# Altium project pdmlse_pcb.PrjPcb (part 3 of 4)

## Sheet LDO_AUX.SchDoc
size B; SheetNumber: 3; SheetTotal: 15
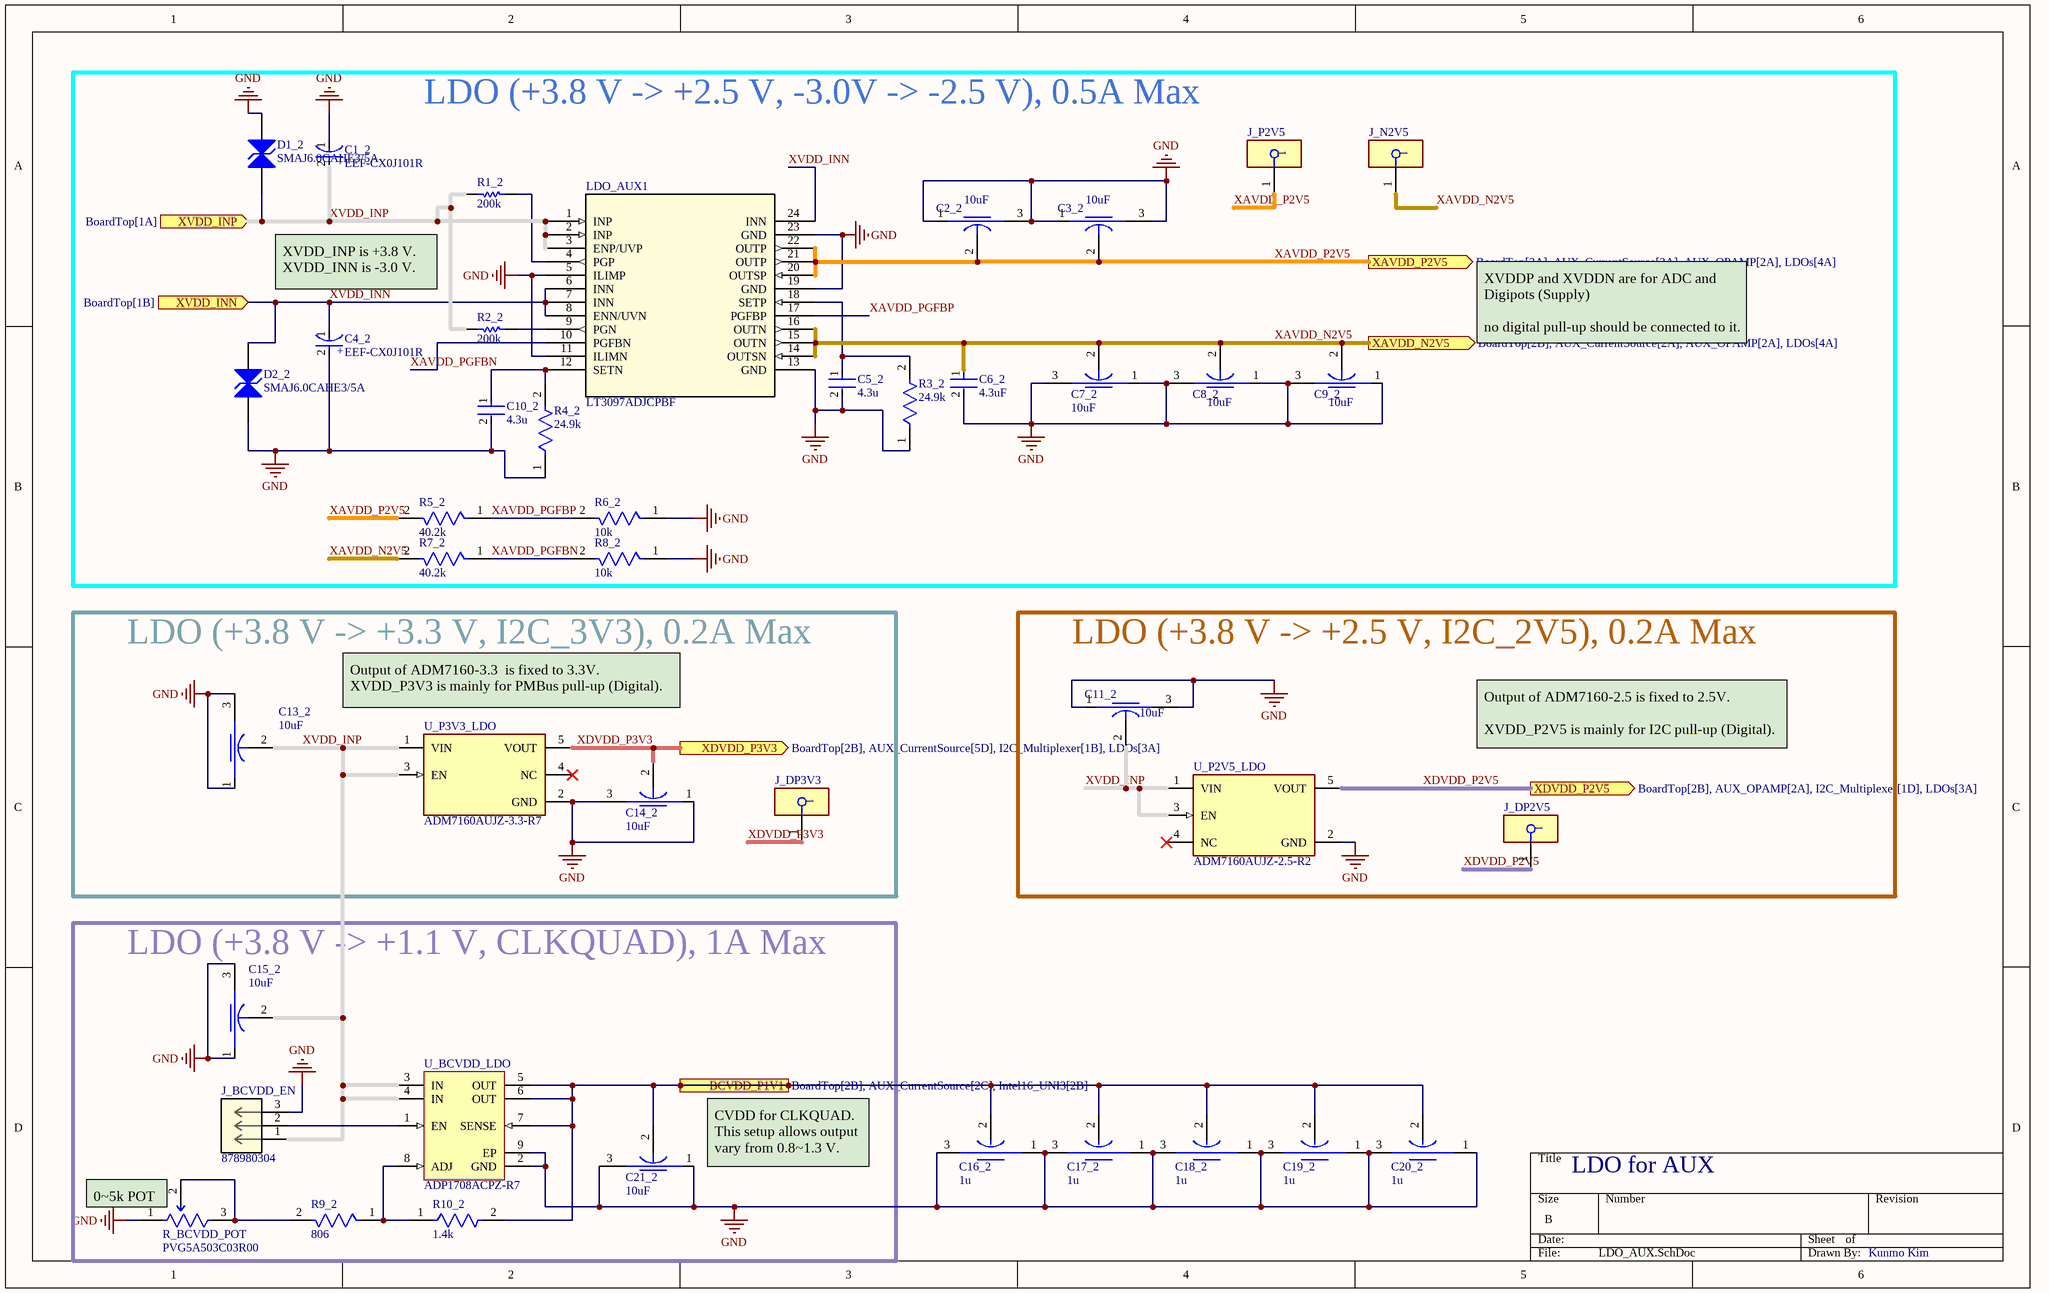
[diagram p5: LDO_AUX.SchDoc]

### Parts
C1_2  EEF-CX0J101R  [FP-CX-MFG]
C2_2  10uF  [FP-NFM15-0_2-MFG]
C3_2  10uF  [FP-NFM15-0_2-MFG]
C4_2  EEF-CX0J101R  [FP-CX-MFG]
C5_2  4.3u  [FP-LLL1U4-0_05-IPC_C]
C6_2  4.3uF  [FP-LLL1U4-0_05-MFG]
C7_2  10uF  [FP-NFM15-0_2-MFG]
C8_2  10uF  [FP-NFM15-0_2-MFG]
C9_2  10uF  [FP-NFM15-0_2-MFG]
C10_2  4.3u  [FP-LLL1U4-0_05-IPC_C]
C11_2  10uF  [FP-NFM15-0_2-MFG]
C13_2  10uF  [FP-NFM15-0_2-MFG]
C14_2  10uF  [FP-NFM15-0_2-MFG]
C15_2  10uF  [FP-NFM15-0_2-MFG]
C16_2  1u  [PCBComponent_1]
C17_2  1u  [PCBComponent_1]
C18_2  1u  [PCBComponent_1]
C19_2  1u  [PCBComponent_1]
C20_2  1u  [PCBComponent_1]
C21_2  10uF  [FP-NFM15-0_2-MFG]
D1_2  SMAJ6.0CAHE3/5A  [VISH-DO-214AC-2_L]
D2_2  SMAJ6.0CAHE3/5A  [VISH-DO-214AC-2_L]
J_BCVDD_EN  878980304  [CONN03_87898_M-5p84_MOL]
J_DP2V5  5019  [FP-5019-MFG]  (value not drawn)
J_DP3V3  5019  [FP-5019-MFG]  (value not drawn)
J_N2V5  5019  [FP-5019-MFG]  (value not drawn)
J_P2V5  5019  [FP-5019-MFG]  (value not drawn)
LDO_AUX1  LT3097ADJCPBF  [05-08-7071_ADI]
R1_2  200k  [RESC1005X40X25NL05T05]
R2_2  200k  [RESC1005X40X25NL05T05]
R3_2  24.9k  [FP-ERJ2RK-MFG]
R4_2  24.9k  [FP-ERJ2RK-MFG]
R5_2  40.2k  [FP-ERJ2RK-MFG]
R6_2  10k  [FP-ERA2A-MFG]
R7_2  40.2k  [FP-ERJ2RK-MFG]
R8_2  10k  [FP-ERA2A-MFG]
R9_2  806  [FP-ERJ2RK-MFG]
R10_2  1.4k  [FP-RT0603-MFG]
R_BCVDD_POT  PVG5A503C03R00  [FP-PVG5A-MFG]
U_BCVDD_LDO  ADP1708ACPZ-R7  [ADI-CP-8-2_N]
U_P2V5_LDO  ADM7160AUJZ-2.5-R2  [FP-UJ-5-IPC_A]
U_P3V3_LDO  ADM7160AUJZ-3.3-R7  [FP-UJ-5-IPC_A]

### Blocks framed on the sheet
LDO (+3.8 V -> +2.5 V, -3.0V -> -2.5 V), 0.5A Max: C1_2 C2_2 C3_2 C4_2 C5_2 C6_2 C7_2 C8_2 C9_2 C10_2 D1_2 D2_2 J_N2V5 J_P2V5 LDO_AUX1 R1_2 R2_2 R3_2 R4_2 R5_2 R6_2 R7_2 R8_2
LDO (+3.8 V -> +3.3 V, I2C_3V3), 0.2A Max: C13_2 C14_2 J_DP3V3 U_P3V3_LDO
LDO (+3.8 V -> +2.5 V, I2C_2V5), 0.2A Max: C11_2 J_DP2V5 U_P2V5_LDO
LDO (+3.8 V -> +1.1 V, CLKQUAD), 1A Max: C15_2 C21_2 J_BCVDD_EN R9_2 R10_2 R_BCVDD_POT U_BCVDD_LDO

### Ports
BCVDD_P1V1 (out, see BoardTop[2B], AUX_CurrentSource[2C], Intel16_UNI3[2B]), XAVDD_N2V5 (out, see BoardTop[2B], AUX_CurrentSource[2A], AUX_OPAMP[2A], LDOs[4A]), XAVDD_P2V5 (out, see BoardTop[2A], AUX_CurrentSource[2A], AUX_OPAMP[2A], LDOs[4A]), XDVDD_P2V5 (out, see BoardTop[2B], AUX_OPAMP[2A], I2C_Multiplexer[1D], LDOs[3A]), XDVDD_P3V3 (out, see BoardTop[2B], AUX_CurrentSource[5D], I2C_Multiplexer[1B], LDOs[3A]), XVDD_INN (in, see BoardTop[1B]), XVDD_INP (in, see BoardTop[1A])

### Nets
GND: C1_2.1(C) C2_2.1(Input) C2_2.3(Output) C3_2.1(Input) C3_2.3(Output) C4_2.2(A) C5_2.2 C6_2.2 C7_2.1(Input) C7_2.3(Output) C8_2.1(Input) C8_2.3(Output) C9_2.1(Input) C9_2.3(Output) C10_2.2 C11_2.1(Input) C11_2.3(Output) C13_2.1(Input) C13_2.3(Output) C14_2.1(Input) C14_2.3(Output) C15_2.1(Input) C15_2.3(Output) C16_2.1(Input) C16_2.3(Output) C17_2.1(Input) C17_2.3(Output) C18_2.1(Input) C18_2.3(Output) C19_2.1(Input) C19_2.3(Output) C20_2.1(Input) C20_2.3(Output) C21_2.1(Input) C21_2.3(Output) D1_2.2(A2) D2_2.1(A1) J_BCVDD_EN.3 LDO_AUX1.5(ILIMP) LDO_AUX1.11(ILIMN) LDO_AUX1.13(GND) LDO_AUX1.19(GND) LDO_AUX1.23(GND) R3_2.1 R4_2.1 R6_2.1 R8_2.1 R_BCVDD_POT.1(CCW) U_BCVDD_LDO.2(GND) U_BCVDD_LDO.9(EP) U_P2V5_LDO.2(GND) U_P3V3_LDO.2(GND)
XAVDD_N2V5: C6_2.1 C7_2.2(GND) C8_2.2(GND) C9_2.2(GND) J_N2V5.1 LDO_AUX1.14(OUTSN) LDO_AUX1.15(OUTN) LDO_AUX1.16(OUTN) R7_2.2 ; port XAVDD_N2V5
XAVDD_P2V5: C2_2.2(GND) C3_2.2(GND) J_P2V5.1 LDO_AUX1.20(OUTSP) LDO_AUX1.21(OUTP) LDO_AUX1.22(OUTP) R5_2.2 ; port XAVDD_P2V5
XDVDD_P2V5: J_DP2V5.1 U_P2V5_LDO.5(VOUT) ; port XDVDD_P2V5
XDVDD_P3V3: C14_2.2(GND) J_DP3V3.1 U_P3V3_LDO.5(VOUT) ; port XDVDD_P3V3
BCVDD_P1V1: C16_2.2(GND) C17_2.2(GND) C18_2.2(GND) C19_2.2(GND) C20_2.2(GND) C21_2.2(GND) R10_2.2 U_BCVDD_LDO.5(OUT) U_BCVDD_LDO.6(OUT) U_BCVDD_LDO.7(SENSE) ; port BCVDD_P1V1
XAVDD_PGFBN: LDO_AUX1.10(PGFBN) R7_2.1 R8_2.2
XAVDD_PGFBP: LDO_AUX1.17(PGFBP) R5_2.1 R6_2.2
XVDD_INN: C4_2.1(C) D2_2.2(A2) LDO_AUX1.6(INN) LDO_AUX1.7(INN) LDO_AUX1.8(ENN/UVN) LDO_AUX1.24(INN) ; port XVDD_INN
XVDD_INP: C1_2.2(A) C11_2.2(GND) C13_2.2(GND) C15_2.2(GND) D1_2.1(A1) J_BCVDD_EN.1 LDO_AUX1.1(INP) LDO_AUX1.2(INP) LDO_AUX1.3(ENP/UVP) R1_2.2 R2_2.2 U_BCVDD_LDO.3(IN) U_BCVDD_LDO.4(IN) U_P2V5_LDO.1(VIN) U_P2V5_LDO.3(EN) U_P3V3_LDO.1(VIN) U_P3V3_LDO.3(EN) ; port XVDD_INP
NetC5_2_1: C5_2.1 LDO_AUX1.18(SETP) R3_2.2
NetC10_2_1: C10_2.1 LDO_AUX1.12(SETN) R4_2.2
NetJ_BCVDD_EN_2: J_BCVDD_EN.2 U_BCVDD_LDO.1(EN)
NetLDO_AUX1_4: LDO_AUX1.4(PGP) R1_2.1
NetLDO_AUX1_9: LDO_AUX1.9(PGN) R2_2.1
NetR9_2_1: R9_2.1 R10_2.1 U_BCVDD_LDO.8(ADJ)
NetR9_2_2: R9_2.2 R_BCVDD_POT.2(WIPER) R_BCVDD_POT.3(CW)

Not connected (* = marked no-connect by the designer): U_P2V5_LDO 4(NC)*; U_P3V3_LDO 4(NC)*

### Notes on the sheet
- XVDD_INP is +3.8 V.
  XVDD_INN is -3.0 V.
- XVDDP and XVDDN are for ADC and Digipots (Supply)
  no digital pull-up should be connected to it.
- (near U_P3V3_LDO) Output of ADM7160-3.3  is fixed to 3.3V.
  XVDD_P3V3 is mainly for PMBus pull-up (Digital).
- Output of ADM7160-2.5 is fixed to 2.5V.
  XVDD_P2V5 is mainly for I2C pull-up (Digital).
- (near C21_2) CVDD for CLKQUAD.
  This setup allows output
  vary from 0.8~1.3 V.
- LDO for AUX
- (near R_BCVDD_POT) 0~5k POT
- Kunmo Kim
- (in symbol CMP-05427-000056-1) +

### Library data of the parts
C1_2 C4_2 = CMP-05427-000056-1: CAP ALUM POLY 100UF 20% 6.3V SMD; Leakage Current: 63uA; Polarity: Polar; Lead Diameter: 2.4mm; Dissipation Factor: 0.06%; Ripple Current: 2.7A; ESR (Equivalent Series Resistance): 15mR; Life (Hours): 1000Hour; Voltage Rating: 6.3V; Case/Package: 2917; Lead Pitch: 1.3mm; Series: SP-Cap CX; Weight: 0.004586oz; Radiation Hardening: No; Case Code (Imperial): 2917; Length: 7.3mm; Number of Pins: 2; Lead Free: Lead Free; REACH SVHC: No SVHC; Max Operating Temperature: 105°C; Package Quantity: 3500; Packaging: Tape and Reel; Height - Seated (Max): 0.075inch; Mount: Surface Mount; Height: 1.9mm; Termination: SMD/SMT; Voltage: 6.3V; Construction: Flat; Width: 0.169inch; Ripple Current (AC): 2.7A; Capacitance: 100uF; Voltage Rating (DC): 6.3V; Case Code (Metric): 7343; Min Operating Temperature: -40°C; Tolerance: 20%; RoHS Compliant: Yes; Depth: 4.3mm
C2_2 C3_2 C7_2 C8_2 C9_2 C11_2 C13_2 C14_2 C15_2 C21_2 = CMP-06053-000058-1: CAP FEEDTHRU
C5_2 C6_2 C10_2 = CMP-06035-061933-1: as C9_1 on sheet LDOs; Capacitance: 4.3uF; Tolerance: 20%; Voltage Rating: 4V; Min Operating Temperature: -55°C; Case/Package: 0204; Mount: Surface Mount; Max Operating Temperature: 85°C; Packaging: Tape and Reel; RoHS Compliant: Yes
C16_2 C17_2 C18_2 C19_2 C20_2 = CMP-06053-000757-1: as C12_1 on sheet LDOs; Case/Package: 0402; Max Operating Temperature: 125°C; Min Operating Temperature: -55°C; Mount: Surface Mount; Ratings: AEC-Q200; Series: EMIFIL®, NFM15; Tolerance: 20%; Voltage Rating: 4V; Supplier 1: Mouser; Supplier Part Number 1: 81-NFM15HC105D0G3D
D1_2 D2_2 = CMP-0548-00108-2: Transient Voltage Suppressor, 6.40 to 231 V, 6 V Stand-off Voltage, Bi-Directional, -55 to 155 degC, 2-pin DO-214AC, Pb-Free, Tape and Reel; Manufacturer: Vishay Semiconductor; VBR Bi-Directional (V): 6.4 to 231; VWM (V): 6; IFSM: 40 A; ID (uA): 1600; PPPM (W): 400, 300; PackageDescription: 2-Pin DO-214AC (SMA), Body 4.245 x 2.665 mm; Packing: Tape and Reel; RoHS: TRUE; ComponentLink3Description: Package Specification; ComponentLink2Description: Datasheet; Mounting Technology: Surface Mount; Operating Junction and Storage Temperature Range: -55 to 150 degC; ComponentLink2URL: http://www.vishay.com/docs/88390/smaj50a.pdf; ComponentLink1Description: Manufacturer URL; DatasheetVersion: 12/8/2013; PackageReference: DO-214AC-2; ComponentLink3URL: http://www.vishay.com/docs/88390/smaj50a.pdf; PartNumber: SMAJ6.0CAHE3/5A; ComponentLink1URL: http://www.vishay.com/; Supplier 1: Mouser; Supplier Part Number 1: 78-SMAJ6.0CAHE3_A/H
J_BCVDD_EN = 878980304: as J_DBG_CTRL0 on sheet BoardTop; RefDes: RefDes; Type: Type
J_DP2V5 J_DP3V3 J_N2V5 J_P2V5 = CMP-1672-00008-2: NexarPartId: 22052288; Number of Contacts: 1; Contact Material: Bronze, Silver; Number of Pins: 1; Lead Free: Lead Free; Packaging: Tape and Reel; Mount: Surface Mount; Height: 2.286mm; Contact Plating: Silver; Material: Bronze; Termination: SMD/SMT; REACH SVHC: No SVHC; RoHS: Compliant
LDO_AUX1 = LT3097ADJCPBF: No Description Available; Mfr_Name: Analog Devices Inc; Type: Power Management; RefDes: RefDes; Supplier 1: Mouser; Supplier Part Number 1: 584-LT3097ADJC#PBF
R1_2 R2_2 = CMP-1011-00768-4: Chip Resistor, 200 KOhm, +/- 1%, 100 mW, -55 to 155 degC, 0402 (1005 Metric), RoHS, Tape and Reel; PartNumber: ERJ-2RKF2003X; Manufacturer: Basic Passives; Case\/Package: 0402; Voltage Rating: 50 V; Power Rating: 100 mW; RoHSCompliant: true; Length: 1 mm; DatasheetVersion: 04/2015; ComponentLink2URL: http://industrial.panasonic.com/cdbs/www-data/pdf/RDA0000/AOA0000C86.pdf; Mount: Surface Mount; PackageDescription: 2-Pin Surface Mount Device, Body 1 x 0.5 mm; Tolerance: 1%; Width: 0.5 mm; ComponentLink2Description: Datasheet; Packaging: Tape and Reel; REACH SVHC: No SVHC; Min Operating Temperature: -55 degC; Package Quantity: 10000; ComponentLink1Description: Manufacturer URL; Height: 0.35 mm; ComponentLink1URL: http://www.panasonic.com/; Mounting Technology: Surface Mount; Case Code (Imperial): 0402; PackageReference: 0402; Radiation Hardening: No; Pins: 2; Max Operating Temperature: 155 degC; Resistance: 200 KOhm; Case Code (Metric): 1005
R3_2 R4_2 = CMP-2002-00806-2: RES SMD 24.9K OHM 1% 1/10W 0402; Voltage Rating (DC): 50V; Temperature Coefficient: 100ppm/°C; Max Power Dissipation: 100mW; Resistance: 24.9kR; Size Code: 0402; Series: ERJ; Package Quantity: 1; Packaging: Tape and Reel; Lead Free: Lead Free; Mount: Surface Mount; Construction: Rectangular; Depth: 0.5mm; Contact Plating: Tin; Length: 1mm; Termination: SMD/SMT; Height: 0.016inch; Military Standard: Not; Voltage Rating: 50V; Resistor Type: Thick Film; Number of Terminations: 2; Case/Package: 0402; REACH SVHC: No SVHC; Case Code (Metric): 1005; Power Rating: 100mW; Tolerance: 1%; Weight: 2.8E-05oz; RoHS Compliant: Yes; Case Code (Imperial): 0402; Max Operating Temperature: 155°C; Features: Automotive AEC-Q200; Width: 0.02inch; Resistance Tolerance: 1%; Min Operating Temperature: -55°C
R5_2 R7_2 = CMP-2002-00919-2: RES SMD 40.2K OHM 1% 1/10W 0402; Max Power Dissipation: 100mW; Voltage Rating (DC): 50V; Temperature Coefficient: 100ppm/°C; Resistance: 40.2kR; Case Code (Metric): 1005; REACH SVHC: No SVHC; Height: 0.35mm; Mount: Surface Mount; Series: ERJ; Width: 0.02inch; Contact Plating: Tin; Number of Terminations: 2; Max Operating Temperature: 155°C; Length: 1mm; Case Code (Imperial): 0402; Construction: Rectangular; Depth: 0.5mm; Features: Automotive AEC-Q200; Weight: 2.8E-05oz; Power Rating: 100mW; Lead Free: Lead Free; Case/Package: 0402; Resistor Type: Thick Film; Termination: SMD/SMT; Voltage Rating: 50V; Package Quantity: 1; Packaging: Tape and Reel; Min Operating Temperature: -55°C; Resistance Tolerance: 1%; Military Standard: Not; Tolerance: 1%; Technology: THICK FILM; RoHS Compliant: Yes
R6_2 R8_2 = CMP-2002-05875-2: RES SMD 10K OHM 0.1% 1/16W 0402; Manufacturer Part Number: ERA-2AEB103X; Manufacturer: Panasonic; Temperature Coefficient: 25ppm/°C; Automotive Grade: Grade 0; Resistance: 10kΩ; Power Rating: 0.063W; Voltage Rating: 50V; Value: 10kΩ; RoHS: TRUE; Device Class L3: Chip SMD Resistors; Automotive: Yes; Series: ERA; Height: 0.4mm; Package: ERA2A; Temperature Range Low: -55°C; ComponentLink2Description: Datasheet; Tolerance: 0.1%; Device Class L2: Resistors; Temperature Range High: +155°C; Device Class L1: Passive Components; Digikey Description: RES SMD 10K OHM 0.1% 1/16W 0402; Category: Res; Mouser Description: Thin Film Resistors - SMD 0402 1/16W 10Kohms; Lead Free: Yes; Footprint Url: https://industrial.panasonic.com/cdbs/www-data/pdf/RDM0000/DMM0000COL17.pdf; Composition: Metal Film; Octopart: https://octopart.com/era-2aeb103x-panasonic-9251377; ComponentLink2URL: https://industrial.panasonic.com/cdbs/www-data/pdf/RDM0000/AOA0000C307.pdf; Temperature: -55°C to +155°C
R9_2 = CMP-2002-01074-4: RES SMD 80.6K OHM 1% 1/10W 0402; NexarPartId: 55421299; Max Power Dissipation: 100mW; Temperature Coefficient: 100ppm/°C; Voltage Rating: 50V; Resistance: 80.6kΩ; Length: 1mm; Number of Terminations: 2; REACH SVHC: No SVHC; Composition: Thick Film; Case Code (Imperial): 0402; RoHS: Compliant; Max Operating Temperature: 155°C; Military Standard: Not; Case Code (Metric): 1005; Depth: 500µm; Termination: SMD/SMT; Contact Plating: Tin; Tolerance: 1%; Voltage Rating (DC): 50V; Min Operating Temperature: -55°C; Case/Package: 0402; Schedule B: 8533210045, 8533210045; Height: 400µm; Power Rating: 100mW; Packaging: Cut Tape (CT); Features: Automotive AEC-Q200; Lead Free: Lead Free; Width: 508µm; Lifecycle Status: Production; Mount: Surface Mount
R10_2 = CMP-03412-033782-1: RES SMD 1.4K OHM 0.1% 1/10W 0603; Manufacturer Part Number: RT0603BRD071K4L; Manufacturer: Yageo; Tolerance: 0.001; Voltage Rating: 75V; Temperature Coefficient: 25 ppm/°C; Resistance: 1.4KΩ; Value: 1.4KΩ; Power Rating: 0.1W; Device Class L3: Chip SMD Resistors; Package: RT0603; RoHS: TRUE; Lead Free: Yes; Footprint Url: http://www.yageo.com/exep/pages/download/literatures/PYu-R_Mount_10.pdf; Device Class L2: Resistors; Ipc Land Pattern Name: RESC16080X45; Digikey Description: RES SMD 1.4K OHM 0.1% 1/10W 0603; ComponentLink2Description: Datasheet; Category: Res; Mouser Description: Res Thin Film 0603 1.4k Ohm 0.1% 1/10W ±25ppm/°C Molded SMD Paper T/R; Temperature: -55°C to +155°C; Temperature Range High: +155°C; Octopart: https://octopart.com/rt0603brd071k4l-yageo-1419726; Device Class L1: Passive Components; ComponentLink2URL: http://www.yageo.com/documents/recent/PYu-RT_1-to-0.01_RoHS_L_9.pdf; Series: RT; Height: 0.55mm; Composition: Thin Film; Temperature Range Low: -55°C; Automotive: No
R_BCVDD_POT = CMP-00059-71526922-1: PVG5A502C03R00 Resistor Trimmer, Cermet, 5 kOhm, ± 10%, 250 mW, 12 Turn, Multi Turn, Surface Mount; Temperature Coefficient: 150ppm/°C; Power Rating: 250mW; Resistance: 5kΩ; Number of Turns: 11; Schedule B: 8533400080, 8533400080|8533400080|8533400080|8533400080|8533400080; RoHS: Compliant; Height: 5.1054mm; Max Operating Temperature: 125°C; Min Operating Temperature: -55°C; Mount: Surface Mount; Max Power Dissipation: 250mW; NexarPartId: 71526922; Tolerance: 10%; Composition: Cermet
U_BCVDD_LDO = CMP-0786-00092-1: 1 A, Low Dropout, CMOS Linear Regulator, 2.5 to 5.5 V Vin, 0.8 to 5 V Vout, Industrial, 8-pin QFN (CP-8-2), Reel; Manufacturer: Analog Devices; Vin (max) (V): 5.5; Iout max: 1A; Vin (min) (V): 2.5; Vout Adjustable Range: 0.8V to 5V; Supply Current IGND @ Small Load: 50uA; ComponentLink4Description: URL Link1; Packing: Reel; ComponentLink2Description: Datasheet; ComponentLink1URL: http://www.analog.com/en/index.html; PackageVersion: 061507-B, 06/2007; PartNumber: ADP1708ACPZ-R7; Mounting Technology: Surface Mount; PackageReference: CP-8-2; PackageDescription: 8-Pin Lead Frame Chip Scale Package, Body 3 x 3 mm, Pitch 0.5 mm; DatasheetVersion: Rev. 0; ComponentLink1Description: Manufacturer URL; ComponentLink2URL: http://www.analog.com/static/imported-files/data_sheets/ADP1706_1707_1708.pdf; ComponentLink3Description: Package Specification; ComponentLink3URL: http://www.analog.com/static/imported-files/packages/56953322593982CP_8_2.pdf; ComponentLink4URL: Product URL:http://www.analog.com/en/ADP1708/productSearch.html
U_P2V5_LDO = CMP-09138-000128-1: IC REG LINEAR 2.5V 200MA TSOT5; Number of Outputs: 1; Max Supply Current: 265uA; Min Input Voltage: 2.2V; Accuracy: 1%; Polarity: Positive; Quiescent Current: 10uA; Max Input Voltage: 5.5V; Power Supply Rejection Ratio (PSRR): 49dB; Output Type: Fixed; Dropout Voltage: 150mV; Min Current Limit: 220mA; Output Current: 200mA; Number of Regulators: 1; Case/Package: TSOT; Max Output Current: 200mA; Nominal Output Voltage: 2.5V; Mount: Surface Mount; Output Voltage: 2.5V; Max Operating Temperature: 125°C; Contact Plating: Tin; REACH SVHC: No SVHC; Min Operating Temperature: -40°C; Packaging: Tape and Reel; Number of Pins: 5; RoHS Compliant: Yes; Lead Free: Contains Lead
U_P3V3_LDO = CMP-09138-000051-1: IC REG LINEAR 3.3V 200MA TSOT5; Min Current Limit: 220mA; Dropout Voltage: 150mV; Number of Outputs: 1; Max Input Voltage: 5.5V; Power Supply Rejection Ratio (PSRR): 49dB; Polarity: Positive; Max Supply Current: 265uA; Accuracy: 1%; Min Input Voltage: 2.2V; Output Type: Fixed; Quiescent Current: 10uA; Mount: Surface Mount; Output Voltage: 3.3V; RoHS Compliant: Yes; Lead Free: Contains Lead; Max Operating Temperature: 125°C; Case/Package: TSOT; Number of Pins: 5; Number of Regulators: 1; Max Output Current: 200mA; Min Operating Temperature: -40°C; Output Current: 200mA; Packaging: Tape and Reel; Contact Plating: Tin

## Sheet AUX_OPAMP.SchDoc
size A4; SheetNumber: 4; SheetTotal: 15
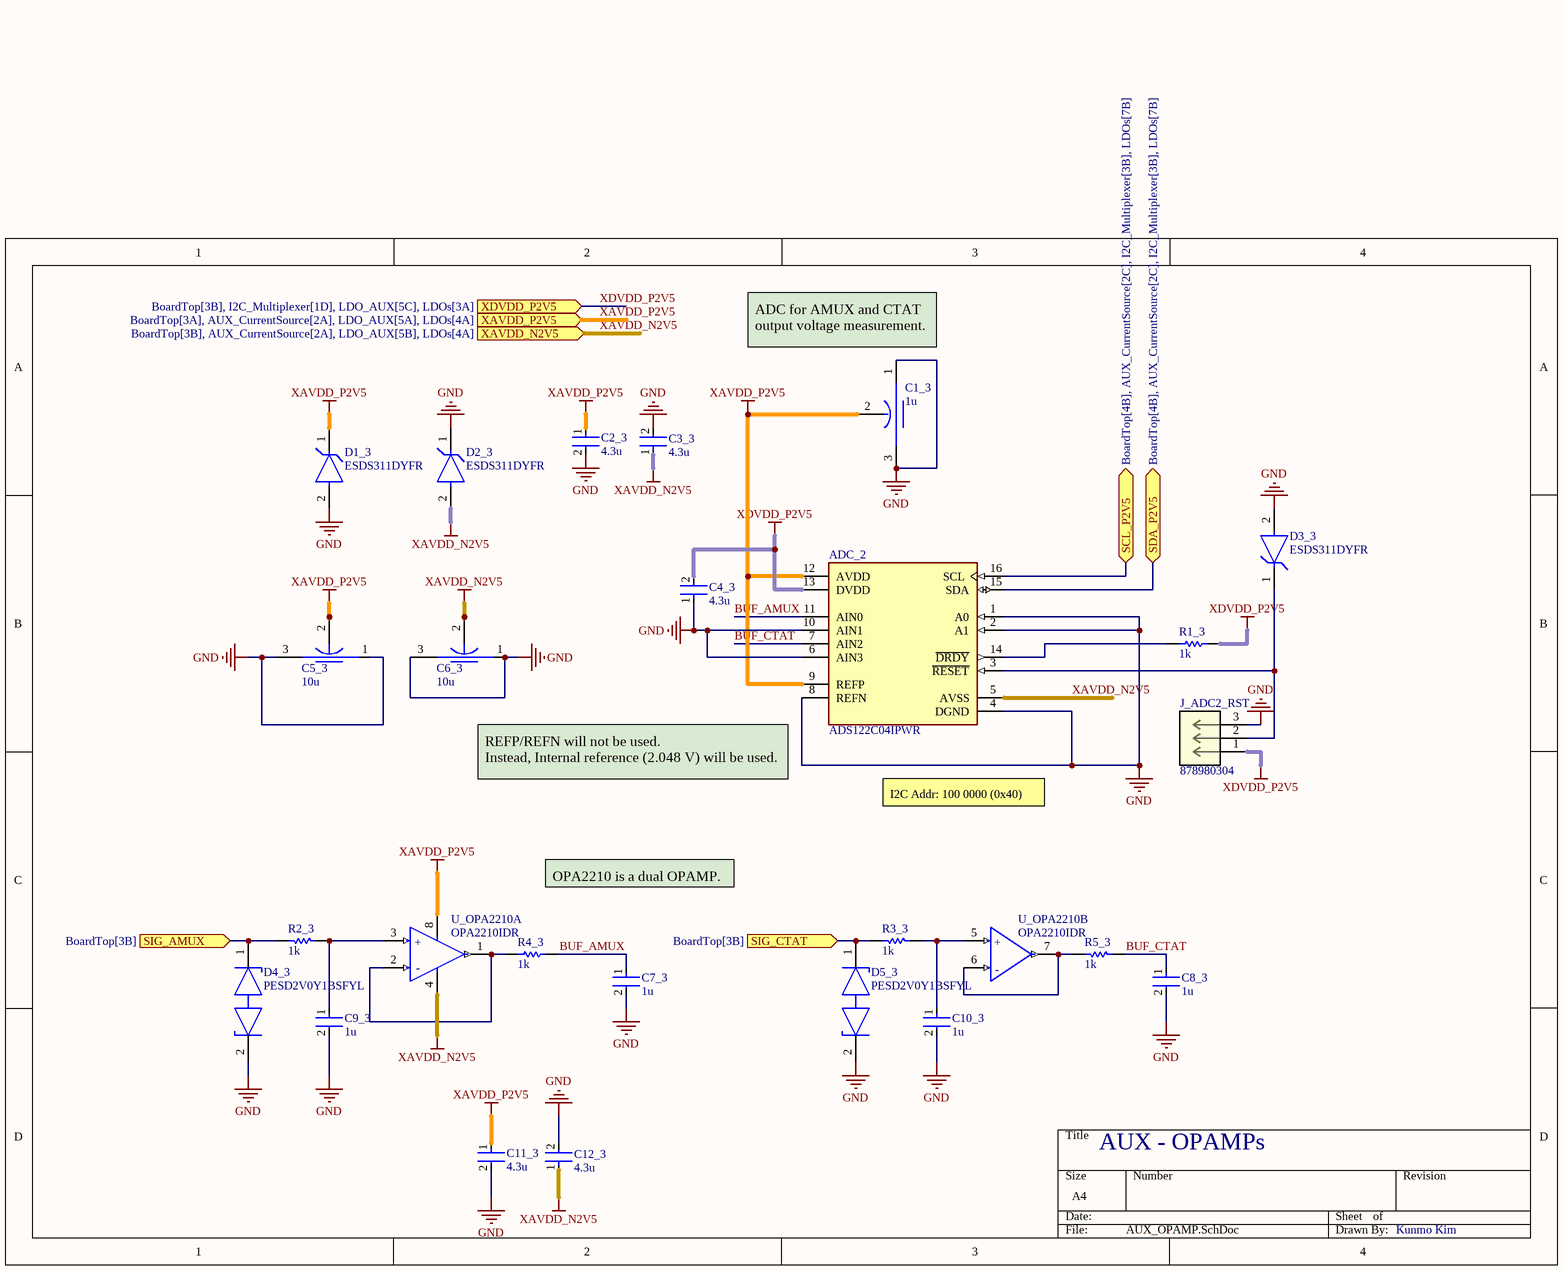
[diagram p6: AUX_OPAMP.SchDoc]

### Parts
ADC_2  ADS122C04IPWR  [FP-PW0016A-IPC_C]
C1_3  1u  [PCBComponent_1]
C2_3  4.3u  [FP-LLL1U4-0_05-MFG]
C3_3  4.3u  [FP-LLL1U4-0_05-MFG]
C4_3  4.3u  [FP-LLL1U4-0_05-MFG]
C5_3  10u  [FP-NFM15-0_2-MFG]
C6_3  10u  [FP-NFM15-0_2-MFG]
C7_3  1u  [FP-C0402C105K8PACTU-IPC_A]
C8_3  1u  [FP-C0402C105K8PACTU-IPC_A]
C9_3  1u  [FP-C0402C105K8PACTU-IPC_A]
C10_3  1u  [FP-C0402C105K8PACTU-IPC_A]
C11_3  4.3u  [FP-LLL1U4-0_05-MFG]
C12_3  4.3u  [FP-LLL1U4-0_05-MFG]
D1_3  ESDS311DYFR  [FP-DYF0002A-IPC_B]
D2_3  ESDS311DYFR  [FP-DYF0002A-IPC_B]
D3_3  ESDS311DYFR  [FP-DYF0002A-IPC_B]
D4_3  PESD2V0Y1BSFYL  [FP-SOD962-2-MFG]
D5_3  PESD2V0Y1BSFYL  [FP-SOD962-2-MFG]
J_ADC2_RST  878980304  [CONN03_87898_M-5p84_MOL]
R1_3  1k  [RESC1608X55X30LL15T15]
R2_3  1k  [RESC1608X55X30LL15T15]
R3_3  1k  [RESC1608X55X30LL15T15]
R4_3  1k  [RESC1608X55X30LL15T15]
R5_3  1k  [RESC1608X55X30LL15T15]
U_OPA2210  OPA2210IDR  [FP-D0008A-MFG]  (parts A,B of 2)

### Ports
SCL_P2V5 (bidir, see BoardTop[4B], AUX_CurrentSource[2C], I2C_Multiplexer[3B], LDOs[7B]), SDA_P2V5 (bidir, see BoardTop[4B], AUX_CurrentSource[2C], I2C_Multiplexer[3B], LDOs[7B]), SIG_AMUX (in, see BoardTop[3B]), SIG_CTAT (in, see BoardTop[3B]), XAVDD_N2V5 (in, see BoardTop[3B], AUX_CurrentSource[2A], LDO_AUX[5B], LDOs[4A]), XAVDD_P2V5 (in, see BoardTop[3A], AUX_CurrentSource[2A], LDO_AUX[5A], LDOs[4A]), XDVDD_P2V5 (in, see BoardTop[3B], I2C_Multiplexer[1D], LDO_AUX[5C], LDOs[3A])

### Nets
GND: ADC_2.1(A0) ADC_2.2(A1) ADC_2.4(DGND) ADC_2.6(AIN3) ADC_2.8(REFN) ADC_2.10(AIN1) C1_3.1(Input) C1_3.3(Output) C2_3.2 C3_3.2 C4_3.1 C5_3.1(Input) C5_3.3(Output) C6_3.1(Input) C6_3.3(Output) C7_3.2 C8_3.2 C9_3.2 C10_3.2 C11_3.2 C12_3.2 D1_3.2(GND) D2_3.1(I/O) D3_3.2(GND) D4_3.2(K2) D5_3.2(K2) J_ADC2_RST.3
XAVDD_N2V5: ADC_2.5(AVSS) C3_3.1 C6_3.2(GND) C12_3.1 D2_3.2(GND) U_OPA2210.4(V-) ; port XAVDD_N2V5
XAVDD_P2V5: ADC_2.9(REFP) ADC_2.12(AVDD) C1_3.2(GND) C2_3.1 C5_3.2(GND) C11_3.1 D1_3.1(I/O) U_OPA2210.8(V+) ; port XAVDD_P2V5
XDVDD_P2V5: ADC_2.13(DVDD) C4_3.2 J_ADC2_RST.1 R1_3.1 ; port XDVDD_P2V5
BUF_AMUX: ADC_2.11(AIN0) C7_3.1 R4_3.1
BUF_CTAT: ADC_2.7(AIN2) C8_3.1 R5_3.2
SCL_P2V5: ADC_2.16(SCL) ; port SCL_P2V5
SDA_P2V5: ADC_2.15(SDA) ; port SDA_P2V5
SIG_AMUX: D4_3.1(K1) R2_3.1 ; port SIG_AMUX
SIG_CTAT: D5_3.1(K1) R3_3.1 ; port SIG_CTAT
NetADC_2_3: ADC_2.3(~{RESET}) D3_3.1(I/O) J_ADC2_RST.2
NetADC_2_14: ADC_2.14(~{DRDY}) R1_3.2
NetC9_3_1: C9_3.1 R2_3.2 U_OPA2210.3(+IN_A)
NetC10_3_1: C10_3.1 R3_3.2 U_OPA2210.5(+IN_B)
NetR4_3_2: R4_3.2 U_OPA2210.1(OUT_A) U_OPA2210.2(-IN_A)
NetR5_3_1: R5_3.1 U_OPA2210.6(-IN_B) U_OPA2210.7(OUT_B)

### Notes on the sheet
- (near C1_3) ADC for AMUX and CTAT
  output voltage measurement.
- REFP/REFN will not be used.
  Instead, Internal reference (2.048 V) will be used.
- I2C Addr: 100 0000 (0x40)
- OPA2210 is a dual OPAMP.
- AUX - OPAMPs
- Kunmo Kim
- (in symbol CMP-04895-000036-1, part A) +; -
- (in symbol CMP-04895-000036-1, part B) +; -

### Library data of the parts
ADC_2 = CMP-04860-000041-1: IC ADC 24BIT SIGMA-DELTA 16TSSOP; Sampling Rate: 2000S/s; Number of Bits: 24; Number of A/D Converters: 1; Number of Inputs: 4; Interface: I2C; Packaging: Tape and Reel; Case/Package: TSSOP; Mount: Surface Mount; RoHS Compliant: Yes; Max Operating Temperature: 125°C; Number of Pins: 16; Min Operating Temperature: -40°C
C1_3 = CMP-06053-000757-1: 0402(1005M) 4V 1.0UF +/- 20% 3 T; Capacitance: 1uF; Current: 2A; Case/Package: 0402; Max Operating Temperature: 125°C; Min Operating Temperature: -55°C; Mount: Surface Mount; Ratings: AEC-Q200; Series: EMIFIL®, NFM15; Tolerance: 20%; Voltage Rating: 4V; Supplier 1: Mouser; Supplier Part Number 1: 81-NFM15HC105D0G3D
C2_3 C3_3 C4_3 C11_3 C12_3 = CMP-06035-061933-1: Cap Ceramic Monolithic 4.3uF 20% 4V X5R 15% 02404 (0610M); Capacitance: 4.3uF; Tolerance: 20%; Min Operating Temperature: -55°C; Case/Package: 0204; Voltage Rating: 4V; Mount: Surface Mount; Max Operating Temperature: 85°C; Packaging: Tape and Reel; RoHS Compliant: Yes
C5_3 C6_3 = CMP-06053-000058-1: CAP FEEDTHRU
C7_3 C8_3 C9_3 C10_3 = CMP-2008-02081-2: CAP CER 1UF 10V X5R 0402; Dielectric Material: Ceramic; Dissipation Factor: 5%; Tolerance: 10%; Number of Pins: 2; Contact Plating: Tin; Min Operating Temperature: -55°C; Termination: SMD/SMT; Lead Free: Lead Free; Construction: Flat; Voltage Rating (DC): 10V; Mount: Surface Mount; Series: C; Thickness: 0.022inch; Width: 0.5mm; Radiation Hardening: No; Capacitance: 1uF; Dielectric: X5R; Height: 0.5mm; Voltage: 10V; Length: 1mm; Depth: 0.5mm; Max Operating Temperature: 85°C; Package Quantity: 1; Packaging: Tape and Reel; RoHS Compliant: Yes; Case Code (Imperial): 0402; Case Code (Metric): 1005; REACH SVHC: No SVHC; Voltage Rating: 10V; Case/Package: 0402; Supplier 1: Mouser; Supplier Part Number 1: 80-C0402C105K8P
D1_3 D2_3 D3_3 = CMP-00370-147271020-1: ESDS311DYFR One-channel unidirectional device for 3.3V surge protection in SOD-323 package 2-SOT -40 to 125; Manufacturer Lifecycle Status: ACTIVE; Number of Pins: 2; Width: 1.7mm; Length: 1.3mm; NexarPartId: 147271020; Height: 0m; Case/Package: SOT; Thickness: 850µm; Lifecycle Status: Production
D4_3 D5_3 = CMP-14436-000022-1: TVS DIODE 2VWM 3VC DSN0603-2
J_ADC2_RST = 878980304: No Description Available; Mfr_Name: Molex Connector Corporation; RefDes: RefDes; Type: Type
R1_3 R2_3 R3_3 R4_3 R5_3 = CMP-2000-00180-1: Part Number: ERJ-3EKF1001V; Manufacturer: Panasonic; Supplier 1: Mouser; Supplier Part Number 1: 667-ERJ-3EKF1001V
U_OPA2210 = CMP-04895-000036-1: IC OP-AMP; Manufacturer: Texas Instruments; Max Dual Supply Voltage: 18V; Nominal Supply Current: 2.2mA; Standoff Height: 0.11mm; Number Of Channels: 2; Max Supply Voltage: 36V; Min Supply Voltage: 4.5V; Max Junction Temp: +150°C; Input Bias Current: 0.0003uA; Min Dual Supply Voltage: 2.25V; Gain Bandwidth: 18MHz; Output Current Per Channel: 65mA; Octopart: https://octopart.com/opa2210idr-texas+instruments-105815795; Temperature Range Low: -55°C; ComponentLink2URL: https://www.ti.com/lit/ds/symlink/opa2210.pdf; Package: D0008A; Ambient Temperature Range Low: -55°C; Manufacturer Part Number: OPA2210IDR; Automotive: No; Temperature Range High: +150°C; Height: 1.75mm; Ambient Temperature Range High: +150°C; ComponentLink2Description: Datasheet; Device Class L2: Linear ICs; Category: IC; Device Class L1: Integrated Circuits (ICs); Digikey Description: IC OP-AMP; Device Class L3: Amplifiers - Op Amps; RoHS: TRUE; Temperature: -55°C to +150°C; Lead Free: Yes

## Sheet AUX_CurrentSource.SchDoc
size B; SheetNumber: 5; SheetTotal: 15
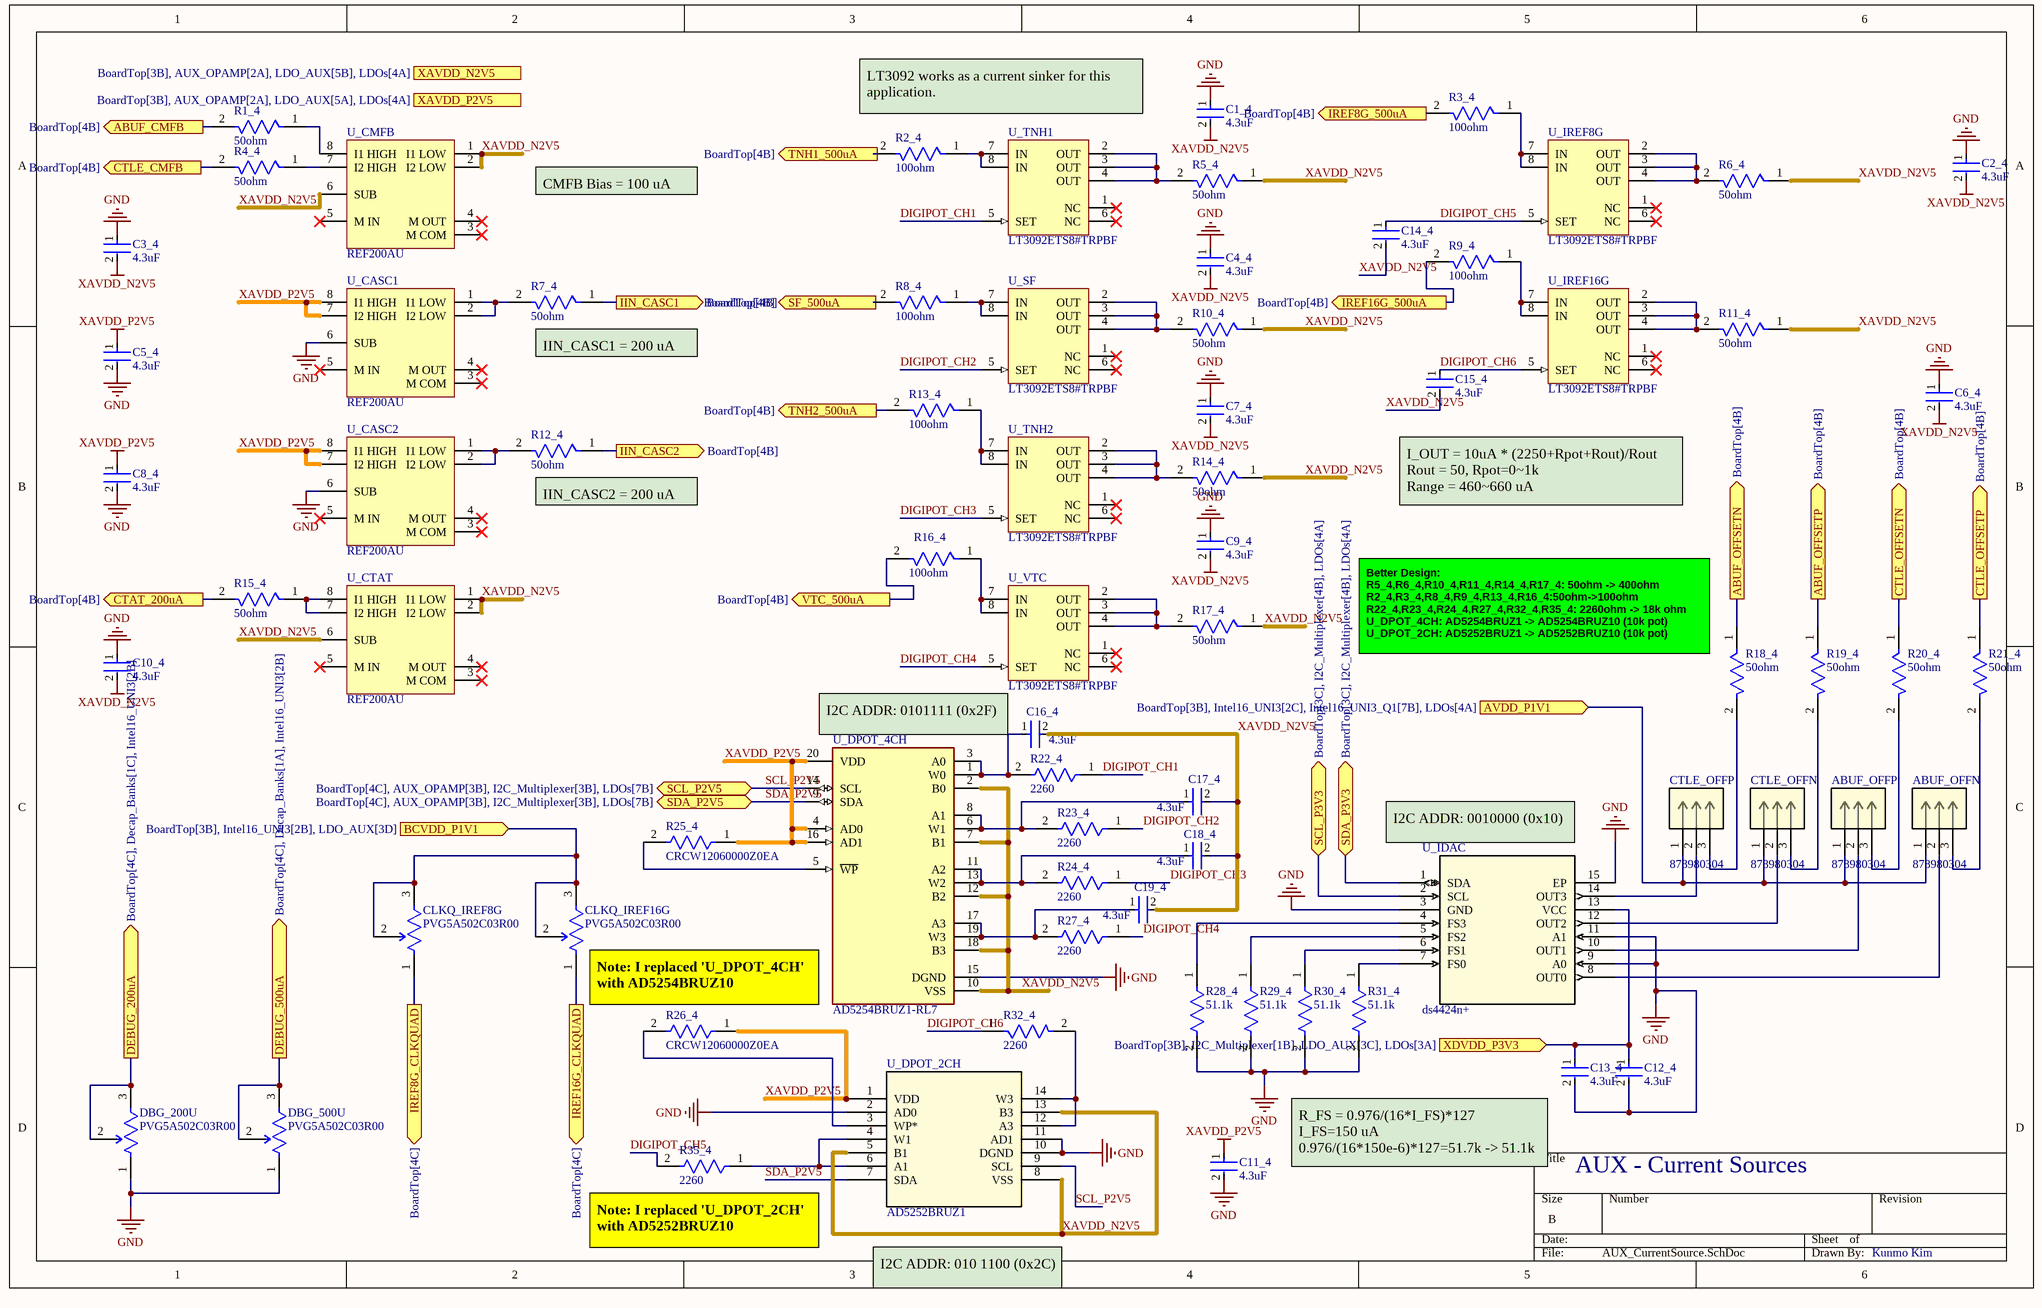
[diagram p7: AUX_CurrentSource.SchDoc]

### Parts
ABUF_OFFN  878980304  [CONN03_87898_M-5p84_MOL]
ABUF_OFFP  878980304  [CONN03_87898_M-5p84_MOL]
C1_4  4.3uF  [FP-LLL1U4-0_05-MFG]
C2_4  4.3uF  [FP-LLL1U4-0_05-MFG]
C3_4  4.3uF  [FP-LLL1U4-0_05-MFG]
C4_4  4.3uF  [FP-LLL1U4-0_05-MFG]
C5_4  4.3uF  [FP-LLL1U4-0_05-MFG]
C6_4  4.3uF  [FP-LLL1U4-0_05-MFG]
C7_4  4.3uF  [FP-LLL1U4-0_05-MFG]
C8_4  4.3uF  [FP-LLL1U4-0_05-MFG]
C9_4  4.3uF  [FP-LLL1U4-0_05-MFG]
C10_4  4.3uF  [FP-LLL1U4-0_05-MFG]
C11_4  4.3uF  [FP-LLL1U4-0_05-MFG]
C12_4  4.3uF  [FP-LLL1U4-0_05-MFG]
C13_4  4.3uF  [FP-LLL1U4-0_05-MFG]
C14_4  4.3uF  [FP-LLL1U4-0_05-MFG]
C15_4  4.3uF  [FP-LLL1U4-0_05-MFG]
C16_4  4.3uF  [FP-LLL1U4-0_05-MFG]
C17_4  4.3uF  [FP-LLL1U4-0_05-MFG]
C18_4  4.3uF  [FP-LLL1U4-0_05-MFG]
C19_4  4.3uF  [FP-LLL1U4-0_05-MFG]
CLKQ_IREF8G  PVG5A502C03R00  [FP-PVG5A-MFG]
CLKQ_IREF16G  PVG5A502C03R00  [FP-PVG5A-MFG]
CTLE_OFFN  878980304  [CONN03_87898_M-5p84_MOL]
CTLE_OFFP  878980304  [CONN03_87898_M-5p84_MOL]
DBG_200U  PVG5A502C03R00  [FP-PVG5A-MFG]
DBG_500U  PVG5A502C03R00  [FP-PVG5A-MFG]
R1_4  50ohm  [FP-RT0402-0_35-IPC_A]
R2_4  100ohm  [FP-RT0402-0_35-IPC_A]
R3_4  100ohm  [FP-RT0402-0_35-IPC_A]
R4_4  50ohm  [FP-RT0402-0_35-IPC_A]
R5_4  50ohm  [FP-RT0402-0_35-IPC_A]
R6_4  50ohm  [FP-RT0402-0_35-IPC_A]
R7_4  50ohm  [FP-RT0402-0_35-IPC_A]
R8_4  100ohm  [FP-RT0402-0_35-IPC_A]
R9_4  100ohm  [FP-RT0402-0_35-IPC_A]
R10_4  50ohm  [FP-RT0402-0_35-IPC_A]
R11_4  50ohm  [FP-RT0402-0_35-IPC_A]
R12_4  50ohm  [FP-RT0402-0_35-IPC_A]
R13_4  100ohm  [FP-RT0402-0_35-IPC_A]
R14_4  50ohm  [FP-RT0402-0_35-IPC_A]
R15_4  50ohm  [FP-RT0402-0_35-IPC_A]
R16_4  100ohm  [FP-RT0402-0_35-IPC_A]
R17_4  50ohm  [FP-RT0402-0_35-IPC_A]
R18_4  50ohm  [FP-RT0402-0_35-IPC_A]
R19_4  50ohm  [FP-RT0402-0_35-IPC_A]
R20_4  50ohm  [FP-RT0402-0_35-IPC_A]
R21_4  50ohm  [FP-RT0402-0_35-IPC_A]
R22_4  2260  [FP-RG1005-MFG]
R23_4  2260  [FP-RG1005-MFG]
R24_4  2260  [FP-RG1005-MFG]
R25_4  CRCW12060000Z0EA  [FP-CRCW1206-e3-IPC_C]
R26_4  CRCW12060000Z0EA  [FP-CRCW1206-e3-IPC_C]
R27_4  2260  [FP-RG1005-MFG]
R28_4  51.1k  [FP-RT0603-MFG]
R29_4  51.1k  [FP-RT0603-MFG]
R30_4  51.1k  [FP-RT0603-MFG]
R31_4  51.1k  [FP-RT0603-MFG]
R32_4  2260  [FP-RG1005-MFG]
R35_4  2260  [FP-RG1005-MFG]
U_CASC1  REF200AU  [D0008A_N]
U_CASC2  REF200AU  [D0008A_N]
U_CMFB  REF200AU  [D0008A_N]
U_CTAT  REF200AU  [D0008A_N]
U_DPOT_2CH  AD5252BRUZ1  [RU_14_ADI]
U_DPOT_4CH  AD5254BRUZ1-RL7  [FP-RU-20-IPC_B]
U_IDAC  ds4424n+  [21-0137_T1433+2_MXM]
U_IREF8G  LT3092ETS8#TRPBF  [TSOT-23_TS8]
U_IREF16G  LT3092ETS8#TRPBF  [TSOT-23_TS8]
U_SF  LT3092ETS8#TRPBF  [TSOT-23_TS8]
U_TNH1  LT3092ETS8#TRPBF  [TSOT-23_TS8]
U_TNH2  LT3092ETS8#TRPBF  [TSOT-23_TS8]
U_VTC  LT3092ETS8#TRPBF  [TSOT-23_TS8]

### Ports
ABUF_CMFB (out, see BoardTop[4B]), ABUF_OFFSETN (out, see BoardTop[4B]), ABUF_OFFSETP (out, see BoardTop[4B]), AVDD_P1V1 (in, see BoardTop[3B], Intel16_UNI3[2C], Intel16_UNI3_Q1[7B], LDOs[4A]), BCVDD_P1V1 (in, see BoardTop[3B], Intel16_UNI3[2B], LDO_AUX[3D]), CTAT_200uA (out, see BoardTop[4B]), CTLE_CMFB (out, see BoardTop[4B]), CTLE_OFFSETN (out, see BoardTop[4B]), CTLE_OFFSETP (out, see BoardTop[4B]), DEBUG_200uA (out, see BoardTop[4C], Decap_Banks[1C], Intel16_UNI3[2B]), DEBUG_500uA (out, see BoardTop[4C], Decap_Banks[1A], Intel16_UNI3[2B]), IIN_CASC1 (out, see BoardTop[4B]), IIN_CASC2 (out, see BoardTop[4B]), IREF8G_500uA (out, see BoardTop[4B]), IREF8G_CLKQUAD (out, see BoardTop[4C]), IREF16G_500uA (out, see BoardTop[4B]), IREF16G_CLKQUAD (out, see BoardTop[4C]), SCL_P2V5 (bidir, see BoardTop[4C], AUX_OPAMP[3B], I2C_Multiplexer[3B], LDOs[7B]), SCL_P3V3 (bidir, see BoardTop[3C], I2C_Multiplexer[4B], LDOs[4A]), SDA_P2V5 (bidir, see BoardTop[4C], AUX_OPAMP[3B], I2C_Multiplexer[3B], LDOs[7B]), SDA_P3V3 (bidir, see BoardTop[3C], I2C_Multiplexer[4B], LDOs[4A]), SF_500uA (out, see BoardTop[4B]), TNH1_500uA (out, see BoardTop[4B]), TNH2_500uA (out, see BoardTop[4B]), VTC_500uA (out, see BoardTop[4B]), XAVDD_N2V5 (in, see BoardTop[3B], AUX_OPAMP[2A], LDO_AUX[5B], LDOs[4A]), XAVDD_P2V5 (in, see BoardTop[3B], AUX_OPAMP[2A], LDO_AUX[5A], LDOs[4A]), XDVDD_P3V3 (in, see BoardTop[3B], I2C_Multiplexer[1B], LDO_AUX[3C], LDOs[3A])

### Nets
AVDD_P1V1: ABUF_OFFN.1 ABUF_OFFP.1 CTLE_OFFN.1 CTLE_OFFP.1 ; port AVDD_P1V1
GND: C1_4.1 C2_4.1 C3_4.1 C4_4.1 C5_4.2 C6_4.1 C7_4.1 C8_4.2 C9_4.1 C10_4.1 C11_4.2 C12_4.2 C13_4.2 DBG_200U.1(CCW) DBG_500U.1(CCW) R28_4.2 R29_4.2 R30_4.2 R31_4.2 U_CASC1.6(SUB) U_CASC2.6(SUB) U_DPOT_2CH.2(AD0) U_DPOT_2CH.10(DGND) U_DPOT_2CH.11(AD1) U_DPOT_4CH.15(DGND) U_IDAC.3(GND) U_IDAC.9(A0) U_IDAC.11(A1) U_IDAC.15(EP)
XAVDD_N2V5: C1_4.2 C2_4.2 C3_4.2 C4_4.2 C6_4.2 C7_4.2 C9_4.2 C10_4.2 C14_4.2 C15_4.2 C16_4.2 C17_4.2 C18_4.2 C19_4.2 R5_4.1 R6_4.1 R10_4.1 R11_4.1 R14_4.1 R17_4.1 U_CMFB.1(I1_LOW) U_CMFB.2(I2_LOW) U_CMFB.6(SUB) U_CTAT.1(I1_LOW) U_CTAT.2(I2_LOW) U_CTAT.6(SUB) U_DPOT_2CH.5(B1) U_DPOT_2CH.8(VSS) U_DPOT_2CH.13(B3) U_DPOT_4CH.2(B0) U_DPOT_4CH.7(B1) U_DPOT_4CH.10(VSS) U_DPOT_4CH.12(B2) U_DPOT_4CH.18(B3) ; port XAVDD_N2V5
XAVDD_P2V5: C5_4.1 C8_4.1 C11_4.1 R25_4.1 R26_4.1 U_CASC1.7(I2_HIGH) U_CASC1.8(I1_HIGH) U_CASC2.7(I2_HIGH) U_CASC2.8(I1_HIGH) U_DPOT_2CH.1(VDD) U_DPOT_4CH.4(AD0) U_DPOT_4CH.16(AD1) U_DPOT_4CH.20(VDD) ; port XAVDD_P2V5
XDVDD_P3V3: C12_4.1 C13_4.1 U_IDAC.13(VCC) ; port XDVDD_P3V3
BCVDD_P1V1: CLKQ_IREF8G.2(WIPER) CLKQ_IREF8G.3(CW) CLKQ_IREF16G.2(WIPER) CLKQ_IREF16G.3(CW) ; port BCVDD_P1V1
CLKQUAD_IREF8G: CLKQ_IREF8G.1(CCW) ; port IREF8G_CLKQUAD
CLKQUAD_IREF16G: CLKQ_IREF16G.1(CCW) ; port IREF16G_CLKQUAD
DEBUG_200uA: DBG_200U.2(WIPER) DBG_200U.3(CW) ; port DEBUG_200uA
DEBUG_500uA: DBG_500U.2(WIPER) DBG_500U.3(CW) ; port DEBUG_500uA
DIGIPOT_CH1: R22_4.1 U_TNH1.5(SET)
DIGIPOT_CH2: R23_4.1 U_SF.5(SET)
DIGIPOT_CH3: R24_4.1 U_TNH2.5(SET)
DIGIPOT_CH4: R27_4.1 U_VTC.5(SET)
DIGIPOT_CH5: C14_4.1 R35_4.2 U_IREF8G.5(SET)
DIGIPOT_CH6: C15_4.1 R32_4.1 U_IREF16G.5(SET)
IBIAS_SF: R8_4.2 ; port SF_500uA
IBIAS_TNH1: R2_4.2 ; port TNH1_500uA
IBIAS_TNH2: R13_4.2 ; port TNH2_500uA
IBIAS_VTC: R16_4.2 ; port VTC_500uA
ICMFB_ABUF: R1_4.2 ; port ABUF_CMFB
ICMFB_CTLE: R4_4.2 ; port CTLE_CMFB
IIN_CASC: R12_4.1 ; port IIN_CASC2
IIN_CTAT: R15_4.2 ; port CTAT_200uA
IIN_LVCASC: R7_4.1 ; port IIN_CASC1
IOFFSETN_ABUF: R18_4.1 ; port ABUF_OFFSETN
IOFFSETN_CTLE: R20_4.1 ; port CTLE_OFFSETN
IOFFSETP_ABUF: R19_4.1 ; port ABUF_OFFSETP
IOFFSETP_CTLE: R21_4.1 ; port CTLE_OFFSETP
MAINQUAD_IREF8G: R3_4.2 ; port IREF8G_500uA
MAINQUAD_IREF16G: R9_4.2 ; port IREF16G_500uA
SCL_P2V5: U_DPOT_2CH.9(SCL) U_DPOT_4CH.14(SCL) ; port SCL_P2V5
SCL_P3V3: U_IDAC.2(SCL) ; port SCL_P3V3
SDA_P2V5: U_DPOT_2CH.7(SDA) U_DPOT_4CH.9(SDA) ; port SDA_P2V5
SDA_P3V3: U_IDAC.1(SDA) ; port SDA_P3V3
NetABUF_OFFN_2: ABUF_OFFN.2 U_IDAC.8(OUT0)
NetABUF_OFFN_3: ABUF_OFFN.3 R21_4.2
NetABUF_OFFP_2: ABUF_OFFP.2 U_IDAC.10(OUT1)
NetABUF_OFFP_3: ABUF_OFFP.3 R20_4.2
NetC16_4_1: C16_4.1 R22_4.2 U_DPOT_4CH.1(W0) U_DPOT_4CH.3(A0)
NetC17_4_1: C17_4.1 R23_4.2 U_DPOT_4CH.6(W1) U_DPOT_4CH.8(A1)
NetC18_4_1: C18_4.1 R24_4.2 U_DPOT_4CH.11(A2) U_DPOT_4CH.13(W2)
NetC19_4_1: C19_4.1 R27_4.2 U_DPOT_4CH.17(A3) U_DPOT_4CH.19(W3)
NetCTLE_OFFN_2: CTLE_OFFN.2 U_IDAC.12(OUT2)
NetCTLE_OFFN_3: CTLE_OFFN.3 R19_4.2
NetCTLE_OFFP_2: CTLE_OFFP.2 U_IDAC.14(OUT3)
NetCTLE_OFFP_3: CTLE_OFFP.3 R18_4.2
NetR1_4_1: R1_4.1 U_CMFB.8(I1_HIGH)
NetR2_4_1: R2_4.1 U_TNH1.7(IN) U_TNH1.8(IN)
NetR3_4_1: R3_4.1 U_IREF8G.7(IN) U_IREF8G.8(IN)
NetR4_4_1: R4_4.1 U_CMFB.7(I2_HIGH)
NetR5_4_2: R5_4.2 U_TNH1.2(OUT) U_TNH1.3(OUT) U_TNH1.4(OUT)
NetR6_4_2: R6_4.2 U_IREF8G.2(OUT) U_IREF8G.3(OUT) U_IREF8G.4(OUT)
NetR7_4_2: R7_4.2 U_CASC1.1(I1_LOW) U_CASC1.2(I2_LOW)
NetR8_4_1: R8_4.1 U_SF.7(IN) U_SF.8(IN)
NetR9_4_1: R9_4.1 U_IREF16G.7(IN) U_IREF16G.8(IN)
NetR10_4_2: R10_4.2 U_SF.2(OUT) U_SF.3(OUT) U_SF.4(OUT)
NetR11_4_2: R11_4.2 U_IREF16G.2(OUT) U_IREF16G.3(OUT) U_IREF16G.4(OUT)
NetR12_4_2: R12_4.2 U_CASC2.1(I1_LOW) U_CASC2.2(I2_LOW)
NetR13_4_1: R13_4.1 U_TNH2.7(IN) U_TNH2.8(IN)
NetR14_4_2: R14_4.2 U_TNH2.2(OUT) U_TNH2.3(OUT) U_TNH2.4(OUT)
NetR15_4_1: R15_4.1 U_CTAT.7(I2_HIGH) U_CTAT.8(I1_HIGH)
NetR16_4_1: R16_4.1 U_VTC.7(IN) U_VTC.8(IN)
NetR17_4_2: R17_4.2 U_VTC.2(OUT) U_VTC.3(OUT) U_VTC.4(OUT)
NetR25_4_2: R25_4.2 U_DPOT_4CH.5(~{WP})
NetR26_4_2: R26_4.2 U_DPOT_2CH.3(WP*)
NetR28_4_1: R28_4.1 U_IDAC.4(FS3)
NetR29_4_1: R29_4.1 U_IDAC.5(FS2)
NetR30_4_1: R30_4.1 U_IDAC.6(FS1)
NetR31_4_1: R31_4.1 U_IDAC.7(FS0)
NetR32_4_2: R32_4.2 U_DPOT_2CH.12(A3) U_DPOT_2CH.14(W3)
NetR35_4_1: R35_4.1 U_DPOT_2CH.4(W1) U_DPOT_2CH.6(A1)

Not connected (* = marked no-connect by the designer): U_CASC1 3(M_COM)* 4(M_OUT)* 5(M_IN)*; U_CASC2 3(M_COM)* 4(M_OUT)* 5(M_IN)*; U_CMFB 3(M_COM)* 4(M_OUT)* 5(M_IN)*; U_CTAT 3(M_COM)* 4(M_OUT)* 5(M_IN)*; U_IREF8G 1(NC)* 6(NC)*; U_IREF16G 1(NC)* 6(NC)*; U_SF 1(NC)* 6(NC)*; U_TNH1 1(NC)* 6(NC)*; U_TNH2 1(NC)* 6(NC)*; U_VTC 1(NC)* 6(NC)*

### Notes on the sheet
- LT3092 works as a current sinker for this application.
- CMFB Bias = 100 uA
- (near R7_4) IIN_CASC1 = 200 uA
- (near R12_4) IIN_CASC2 = 200 uA
- I_OUT = 10uA * (2250+Rpot+Rout)/Rout
  Rout = 50, Rpot=0~1k
  Range = 460~660 uA
  i.e.: for 500 uA, Rpot =
- (near R18_4) Better Design:
  R5_4,R6_4,R10_4,R11_4,R14_4,R17_4: 50ohm -> 400ohm
  R2_4,R3_4,R8_4,R9_4,R13_4,R16_4:50ohm->100ohm
  R22_4,R23_4,R24_4,R27_4,R32_4,R35_4: 2260ohm -> 18k ohm
  U_DPOT_4CH: AD5254BRUZ1 -> AD5254BRUZ10 (10k pot)
  U_DPOT_2CH: AD5252BRUZ1 -> AD5252BRUZ10 (10k pot)
- I2C ADDR: 0101111 (0x2F)
- (near U_IDAC) I2C ADDR: 0010000 (0x10)
- Note: I replaced 'U_DPOT_4CH' with AD5254BRUZ10
- (near C13_4) R_FS = 0.976/(16*I_FS)*127
  I_FS=150 uA
  0.976/(16*150e-6)*127=51.7k -> 51.1k
- AUX - Current Sources
- (near R35_4) Note: I replaced 'U_DPOT_2CH' with AD5252BRUZ10
- I2C ADDR: 010 1100 (0x2C)
- Kunmo Kim

### Library data of the parts
ABUF_OFFN ABUF_OFFP CTLE_OFFN CTLE_OFFP = 878980304: as J_ADC2_RST on sheet AUX_OPAMP; RefDes: RefDes; Type: Type
C1_4 C2_4 C3_4 C4_4 C5_4 C6_4 C7_4 C8_4 C9_4 C10_4 C11_4 C12_4 C13_4 C14_4 C15_4 C16_4 C17_4 C18_4 C19_4 = CMP-06035-061933-1: as C2_3 on sheet AUX_OPAMP; Capacitance: 4.3uF; Tolerance: 20%; Min Operating Temperature: -55°C; Case/Package: 0204; Voltage Rating: 4V; Mount: Surface Mount; Max Operating Temperature: 85°C; Packaging: Tape and Reel; RoHS Compliant: Yes
CLKQ_IREF8G CLKQ_IREF16G DBG_200U DBG_500U = CMP-00059-71526922-1: PVG5A502C03R00 Resistor Trimmer, Cermet, 5 kOhm, ± 10%, 250 mW, 12 Turn, Multi Turn, Surface Mount; Temperature Coefficient: 150ppm/°C; Power Rating: 250mW; Resistance: 5kΩ; Number of Turns: 11; Schedule B: 8533400080, 8533400080|8533400080|8533400080|8533400080|8533400080; RoHS: Compliant; Height: 5.1054mm; Max Operating Temperature: 125°C; Min Operating Temperature: -55°C; Mount: Surface Mount; Max Power Dissipation: 250mW; NexarPartId: 71526922; Tolerance: 10%; Composition: Cermet
R1_4 R2_4 R3_4 R4_4 R5_4 R6_4 R7_4 R8_4 R9_4 R10_4 R11_4 R12_4 R13_4 R14_4 R15_4 R16_4 R17_4 R18_4 R19_4 R20_4 R21_4 = CMP-00621-71392720-1: RT0402BRE0750RL Fixed Resistor, Thin Film, 0.0625W, 50ohm, 50V, 0.1% +/-Tol, 50ppm/Cel, Surface Mount, 0402; Max Power Dissipation: 63mW; Temperature Coefficient: 50ppm/°C; Resistance: 50Ω; Features: Moisture Resistant; Max Operating Temperature: 155°C; Tolerance: 0.1%; Min Operating Temperature: -55°C; Case/Package: 0402; Packaging: Tape & Reel; RoHS: Compliant; Width: 508µm; Height: 355.6µm; NexarPartId: 71392720; Composition: Thin Film; Length: 990.6µm; Number of Terminations: 2; Supplier 1: Digikey; Supplier Part Number 1: 13-RT0402BRE0750RLCT-ND
R22_4 R23_4 R24_4 R27_4 R32_4 R35_4 = CMP-28537-006422-1: Automotive Metal Thin Film Chip Resistor, 0402, 2.26kΩ, 0.1%, 25ppm/°C, 0.0625W, 75V; Voltage Rating: 25V; Power Rating: 30mW; Resistance: 2.26kR; Max Power Dissipation: 63mW; Lead Free: Lead Free; Packaging: Tape and Reel; Case/Package: 0402; Termination: SMD/SMT; Series: RG; Length: 0.039inch; Temperature Coefficient: 25ppm/°C; Max Operating Temperature: 155°C; Resistor Type: Thin Film; Features: Automotive AEC-Q200; Height: 0.016inch; Number of Terminations: 2; Case Code (Metric): 1005; Case Code (Imperial): 0402; Voltage Rating (DC): 25V; RoHS Compliant: Yes; Width: 0.02inch; Min Operating Temperature: -55°C; Tolerance: 0.1%; Package Quantity: 5000
R25_4 R26_4 = CMP-2003-04857-2: RES Thick Film, 0Ω, 0.25W, 1206; Resistance: 0mR; Power Rating: 250mW; Temperature Coefficient: 100ppm/°C; Tolerance: 1%; Voltage Rating (DC): 200V; Width: 1.6mm; Termination: SMD/SMT; Contact Plating: Tin; Min Operating Temperature: -55°C; Military Standard: Not; Mount: Surface Mount; Case Code (Metric): 3216; Case Code (Imperial): 1206; Packaging: Tape and Reel; Depth: 1.6mm; Case/Package: 1206; Radiation Hardening: No; Height: 0.55mm; Package Quantity: 5000; Weight: 0.000353oz; Max Operating Temperature: 155°C; Length: 3.2mm; Composition: Thick Film; Lead Free: Lead Free; Voltage Rating: 200V
R28_4 R29_4 R30_4 R31_4 = CMP-2000-04475-2: RES SMD 51.1K OHM 0.1% 1/10W; Manufacturer: Yageo; Manufacturer Part Number: RT0603BRD0751K1L; Tolerance: 0.001; Temperature Coefficient: 25 ppm/°C; Voltage Rating: 75V; Power Rating: 0.1W; Resistance: 51.1KΩ; Value: 51.1KΩ; Height: 0.55mm; ComponentLink2Description: Datasheet; Ipc Land Pattern Name: RESC16080X45; Digikey Description: RES SMD 51.1K OHM 0.1% 1/10W; RoHS: TRUE; Temperature Range Low: -55°C; Composition: Thin Film; Mouser Description: Thin Film Resistors - SMD 1/10W 51.1K ohm .1% 25ppm; Device Class L2: Resistors; Octopart: https://octopart.com/rt0603brd0751k1l-yageo-1281879; Device Class L3: Chip SMD Resistors; Device Class L1: Passive Components; ComponentLink2URL: http://www.yageo.com/documents/recent/PYu-RT_1-to-0.01_RoHS_L_9.pdf; Automotive: No; Series: RT; Category: Res; Lead Free: Yes; Footprint Url: http://www.yageo.com/exep/pages/download/literatures/PYu-R_Mount_10.pdf; Temperature Range High: +155°C; Temperature: -55°C to +155°C; Package: RT0603
U_CASC1 U_CASC2 U_CMFB U_CTAT = CMP-0368-00004-2: Dual Current Source / Current Sink, 2.5 to 40 V, 0.1 mA, -25 to 85 degC, 8-pin SOIC (D), Green (RoHS & no Sb/Br); Manufacturer: Texas Instruments; Iout/Iz(Max)(mA): 0.1; VI(Min)(V): 2.5; VI(Max)(V): 40; SubFamily: Current Reference; Code_JEDEC: MS-012; ComponentLink3URL: http://www.ti.com/litv/pdf/msoi002j; ComponentLink3Description: Package Specification; ComponentLink2Description: Datasheet; PartNumber: REF200AU; DatasheetVersion: SBVS020; ComponentLink2URL: http://www.ti.com/general/docs/lit/getliterature.tsp?genericPartNumber=REF200&fileType=pdf; ComponentLink1Description: Manufacturer URL; PackageVersion: 4040047-3/M; PackageReference: D0008A; ComponentLink1URL: http://www.ti.com/; PackageDescription: 8-Pin Plastic Small Outline, Body 4.9 x 3.9 mm, Pitch 1.27 mm; Eco-Plan: Green (RoHS & no Sb/Br); Mounting Technology: Surface Mount
U_DPOT_2CH = AD5252BRUZ1: No Description Available; Mfr_Name: Analog Devices Inc; RefDes: RefDes; Type: Type; Supplier 1: Mouser; Supplier Part Number 1: 584-AD5252BRUZ1
U_DPOT_4CH = CMP-09083-000143-1: IC DGTL POT 1KOHM 256TAP 20TSSOP; Operating Supply Current: 3uA; Memory Type: Non-Volatile; Min Supply Voltage: 2.7V; Number of Taps: 256; Max Dual Supply Voltage: 2.75V; Dual Supply Voltage: 2.5V; Quiescent Current: 5uA; Tolerance: 30%; Temperature Coefficient: 650ppm/°C; Max Supply Voltage: 5.5V; Number of Elements: 4; Interface: I2C; Frequency: 400kHz; Resistance: 1kR; Min Dual Supply Voltage: 2.25V; -3db Bandwidth: 4MHz; Min Operating Temperature: -40°C; Max Operating Temperature: 85°C; Lead Free: Contains Lead; Case/Package: TSSOP; Mount: Surface Mount; Number of Pins: 20; Package Quantity: 1000; Nominal Supply Current: 3uA; Series: -; Taper: Linear; Number of Positions: 256; Contact Plating: Tin; RoHS Compliant: Yes; Max Supply Current: 5uA; Number of Circuits: 4; Packaging: Tape and Reel
U_IDAC = ds4424n+: No Description Available; Mfr_Name: Analog Devices Inc; RefDes: RefDes; Type: Type; Supplier 1: Mouser; Supplier Part Number 1: 700-DS4424N
U_IREF8G U_IREF16G U_SF U_TNH1 U_TNH2 U_VTC = CMP-0472-00072-1: 200 mA Two-Terminal Programmable Current Source, 0.3 mA Isupply, 8-pin SOT23 (TS8-8), -40 to 125 degC, Pb-Free, Tape and Reel; Manufacturer: Linear Technology; Output Current Range: 0.5 mA to 200 mA; Vin Max(V): 40; Vin Min(V): 1.2; Isupply(mA): 0.3; Initial Accuracy(%): 1; Extended Temp: E, I, MP; ComponentLink2URL: http://cds.linear.com/docs/en/datasheet/3092fb.pdf; RoHS: TRUE; ComponentLink1Description: Manufacturer URL; Mounting Technology: Surface Mount; ComponentLink2Description: Datasheet; DatasheetVersion: Rev. B; ComponentLink1URL: http://www.linear.com/; Packing: Tape and Reel; PackageDescription: 8-Pin Plastic TSOT-23, Body 2.9 x 1.63 mm, Pitch 0.65 mm; PackageVersion: Rev. A, 08/2010; Code_JEDEC: MO-193; PartNumber: LT3092ETS8#TRPBF; ComponentLink3Description: Package Specification; ComponentLink3URL: http://cds.linear.com/docs/en/packaging/SOT_8_05-08-1637.pdf; PackageReference: TS8-8; Supplier 1: Mouser; Supplier Part Number 1: 584-LT3092ETS8#TRPBF